# Altium project Heart_Rate_Monitor.PrjPCB
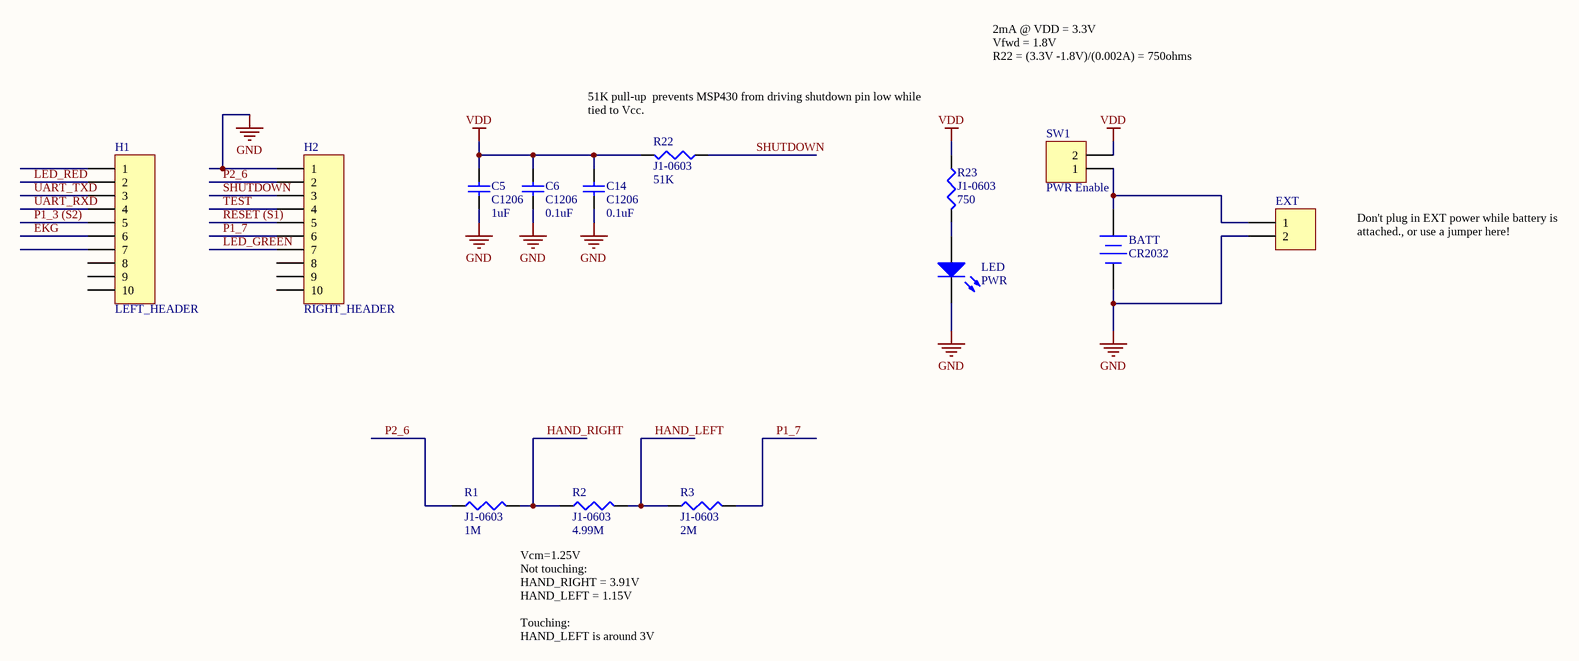
[diagram p0: Connector.SchDoc]
Name: Evan Reeves; Rev: A; Title: Heart Rate Monitor
2 sheets, 44 parts. Net scope: global (net labels, ports and power ports of the same name join across sheets).
Board file: Heart_Rate_Monitor.PcbDoc
Sheets:
  Connector.SchDoc
  Design.SchDoc

## Sheet Connector.SchDoc: Heart-Rate Monitor
size B; DrawnBy: Evan Reeves; Revision: A; SheetNumber: 1; SheetTotal: 2

### Parts
BATT  CR2032  [BAT_3003]
C5  C1206  value 1uF  [C1206]
C6  C1206  value 0.1uF  [C1206]
C14  C1206  value 0.1uF  [C1206]
EXT  (no value)  [BAT-2]
H1  LEFT_HEADER  [HDR1X10]
H2  RIGHT_HEADER  [HDR1X10]
LED  PWR  [RESC0603N]
R1  J1-0603  value 1M  [RESC0603N]
R2  J1-0603  value 4.99M  [RESC0603N]
R3  J1-0603  value 2M  [RESC0603N]
R22  J1-0603  value 51K  [RESC0603N]
R23  J1-0603  value 750  [RESC0603N]
SW1  PWR Enable  [HDR1X2]

### Nets
GND: BATT.2(-) C5.1 C6.1 C14.1 EXT.2 H2.1 LED.2(K)
VDD: C5.2 C6.2 C14.2 R22.2 R23.1 SW1.2
EKG: H1.6
HAND_LEFT: R2.2 R3.1
HAND_RIGHT: R1.2 R2.1
LED_GREEN: H2.7
LED_RED: H1.2
P1_3 (S2): H1.5
P1_7: H2.6 R3.2
P2_6: H2.2 R1.1
RESET (S1): H2.5
SHUTDOWN: H2.3 R22.1
TEST: H2.4
UART_RXD: H1.4
UART_TXD: H1.3
NetBATT_1: BATT.1(+) EXT.1 SW1.1
NetLED_1: LED.1(A) R23.2

Not connected (* = marked no-connect by the designer): H1 1 7 8 9 10; H2 8 9 10

### Notes on the sheet
- 2mA @ VDD = 3.3V
  Vfwd = 1.8V
  R22 = (3.3V -1.8V)/(0.002A) = 750ohms
- (near R22) 51K pull-up  prevents MSP430 from driving shutdown pin low while tied to Vcc.
- Don't plug in EXT power while battery is attached., or use a jumper here!
- Vcm=1.25V
  Not touching:
  HAND_RIGHT = 3.91V
  HAND_LEFT = 1.15V
  Touching:
  HAND_LEFT is around 3V
- Title
- Size:
- Date:
- B
- Number:
- Time:
- Revision:
- Sheet
- of
- File:

### Library data of the parts
BATT = Battery: Multicell Battery; pin to pad: 1>MH1; Published: 24-Mar-1999; LatestRevisionDate: 17-Jul-2002; LatestRevisionNote: Re-released for DXP Platform.; PackageReference: BAT-2; Publisher: Altium Limited; PackageDescription: Battery; 2 Leads
C5 C6 C14 = Cap Semi: Capacitor (Semiconductor SIM Model); Published: 8-Jun-2000; LatestRevisionDate: 29-May-2009; LatestRevisionNote: IPC-7351 Footprint Added.; PackageReference: C1206; Publisher: Altium Limited; PackageDescription: Chip Capacitor
EXT SW1 = Header 2: Header, 2-Pin; LatestRevisionDate: 17-Jul-2002; LatestRevisionNote: Re-released for DXP Platform.; Publisher: Altium Limited
H1 H2 = Header 10: Header, 10-Pin; LatestRevisionDate: 17-Jul-2002; LatestRevisionNote: Re-released for DXP Platform.; Publisher: Altium Limited
LED = LED2: RED LED; PN: SML-311UTT86; Published: 8-Jun-2000; LatestRevisionDate: 17-Jul-2002; LatestRevisionNote: Re-released for DXP Platform.; PackageVersion: Feb-2002; PackageReference: 0603; Publisher: Altium Limited; PackageDescription: SM LED; 2 Flat Leads; Link: https://www.digikey.com/product-detail/en/rohm-semiconductor/SML-311UTT86/511-1304-1-ND/637117
R1-R3 R22 R23 = Res3: Resistor; Published: 8-Jun-2000; LatestRevisionDate: 29-May-2009; LatestRevisionNote: IPC-7351 Footprint Added.; PackageReference: J1-0603; Publisher: Altium Limited; PackageDescription: Chip Resistor

## Sheet Design.SchDoc: Heart Rate Monitor
size B; DrawnBy: Evan Reeves; Revision: A; SheetNumber: 2; SheetTotal: 2
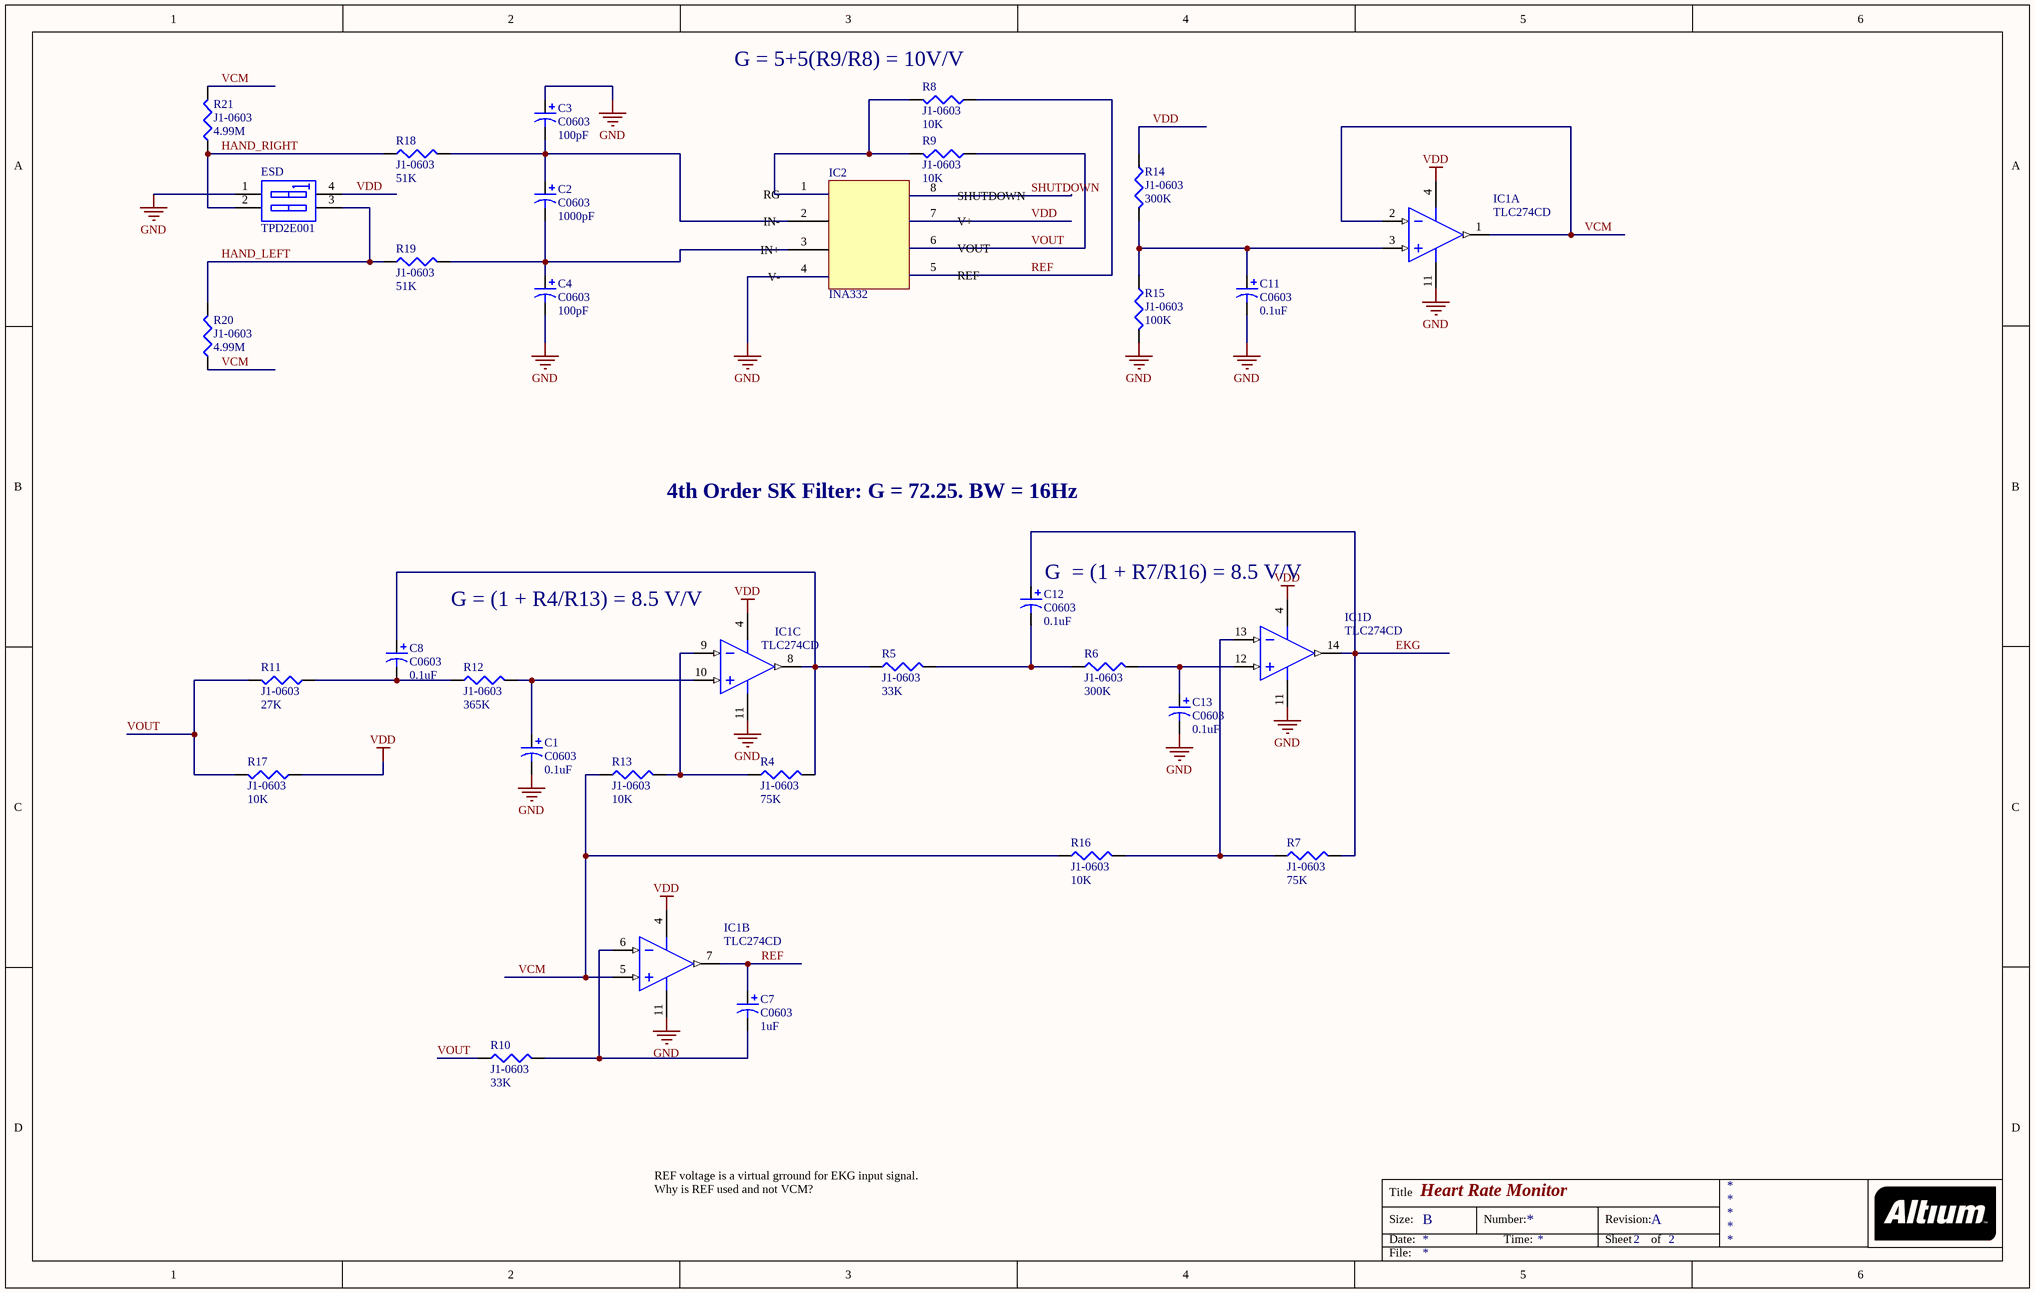
[diagram p1: Design.SchDoc]

### Parts
C1  C0603  value 0.1uF  [RESC0603N]
C2  C0603  value 1000pF  [RESC0603N]
C3  C0603  value 100pF  [RESC0603N]
C4  C0603  value 100pF  [RESC0603N]
C7  C0603  value 1uF  [RESC0603N]
C8  C0603  value 0.1uF  [RESC0603N]
C11  C0603  value 0.1uF  [RESC0603N]
C12  C0603  value 0.1uF  [RESC0603N]
C13  C0603  value 0.1uF  [RESC0603N]
ESD  TPD2E001  [SOT143N]
IC1  TLC274CD  [D014_N]  (parts A,B,C,D of 4)
IC2  INA332  [TSOP65P490-8AN]
R4  J1-0603  value 75K  [RESC0603N]
R5  J1-0603  value 33K  [RESC0603N]
R6  J1-0603  value 300K  [RESC0603N]
R7  J1-0603  value 75K  [RESC0603N]
R8  J1-0603  value 10K  [RESC0603N]
R9  J1-0603  value 10K  [RESC0603N]
R10  J1-0603  value 33K  [RESC0603N]
R11  J1-0603  value 27K  [RESC0603N]
R12  J1-0603  value 365K  [RESC0603N]
R13  J1-0603  value 10K  [RESC0603N]
R14  J1-0603  value 300K  [RESC0603N]
R15  J1-0603  value 100K  [RESC0603N]
R16  J1-0603  value 10K  [RESC0603N]
R17  J1-0603  value 10K  [RESC0603N]
R18  J1-0603  value 51K  [RESC0603N]
R19  J1-0603  value 51K  [RESC0603N]
R20  J1-0603  value 4.99M  [RESC0603N]
R21  J1-0603  value 4.99M  [RESC0603N]

### Nets
GND: C1.2 C3.1 C4.2 C11.2 C13.2 ESD.1(A1) IC1.11(V-) IC2.4(V-) R15.2
VDD: ESD.4(B1) IC1.4(V+) IC2.7(V+) R14.1 R17.1
EKG: C12.1 IC1.14(OUT) R7.2
HAND_LEFT: ESD.3(B2) R19.1 R20.2
HAND_RIGHT: ESD.2(A2) R18.1 R21.1
REF: C7.1 IC1.7(OUT) IC2.5(REF) R8.1
SHUTDOWN: IC2.8(SHUTDOWN)
VCM: IC1.1(OUT) IC1.2(IN-) IC1.5(IN+) R13.1 R16.1 R20.1 R21.2
VOUT: IC2.6(VOUT) R9.1 R10.1 R11.2 R17.2
NetC1_1: C1.1 IC1.10(IN+) R12.2
NetC2_1: C2.1 C3.2 IC2.2(IN-) R18.2
NetC2_2: C2.2 C4.1 IC2.3(IN+) R19.2
NetC7_2: C7.2 IC1.6(IN-) R10.2
NetC8_1: C8.1 IC1.8(OUT) R4.2 R5.1
NetC8_2: C8.2 R11.1 R12.1
NetC11_1: C11.1 IC1.3(IN+) R14.2 R15.1
NetC12_2: C12.2 R5.2 R6.1
NetC13_1: C13.1 IC1.12(IN+) R6.2
NetIC1_9: IC1.9(IN-) R4.1 R13.2
NetIC1_13: IC1.13(IN-) R7.1 R16.2
NetIC2_1: IC2.1(RG) R8.2 R9.2

### Notes on the sheet
- (near R8) G = 5+5(R9/R8) = 10V/V
- 4th Order SK Filter: G = 72.25. BW = 16Hz
- (near IC1) G = (1 + R4/R13) = 8.5 V/V
- (near C12) G  = (1 + R7/R16) = 8.5 V/V
- REF voltage is a virtual grround for EKG input signal. Why is REF used and not VCM?
- Title
- Size:
- Date:
- B
- Number:
- Time:
- Revision:
- Sheet
- of
- File:

### Library data of the parts
C1-C4 C7 C8 C11-C13 = Cap Pol3: Polarized Capacitor (Surface Mount); Published: 8-Jun-2000; LatestRevisionDate: 29-May-2009; LatestRevisionNote: IPC-7351 Footprint Added.; PackageReference: C0603; Publisher: Altium Limited; PackageDescription: Chip Capacitor
ESD = SW DIP-2: DIP Switch, 2 Position, SPST; Published: 24-Mar-1999; LatestRevisionDate: 17-Jul-2002; LatestRevisionNote: Re-released for DXP Platform.; PackageReference: DIP-4; Publisher: Altium Limited
IC1 = TLC274CD: LinCMOS Precision Quad Operational Amplifier; Published: 15-Apr-2002; LatestRevisionDate: 13-Apr-2006; LatestRevisionNote: IPC-7351 Footprint Added.; DatasheetVersion: Aug-1988; PackageVersion: Jan-1998; PackageReference: D014; Publisher: Altium Limited; PackageDescription: 14-Pin Small Outline Integrated Circuit 1.27 mm Pitch; Code_IPC: SOIC127P600-14; ComponentLink1Description: Manufacturer Link; ComponentLink1URL: http://www.ti.com/; ComponentLink2Description: Datasheet; ComponentLink2URL: http://www-s.ti.com/sc/ds/tlc274a.pdf
IC2 = INA332: Instrumentation Amp MSOP-8; PN: INA332AIDGK
R4-R21 = Res3: Resistor; Published: 8-Jun-2000; LatestRevisionDate: 29-May-2009; LatestRevisionNote: IPC-7351 Footprint Added.; PackageReference: J1-0603; Publisher: Altium Limited; PackageDescription: Chip Resistor

## Nets that join several sheets
GND: Connector (7 pins), Design (9 pins)
VDD: Connector (6 pins), Design (5 pins)
EKG: Connector (H1.6), Design (C12.1 IC1.14 R7.2)
HAND_LEFT: Connector (R2.2 R3.1), Design (ESD.3 R19.1 R20.2)
HAND_RIGHT: Connector (R1.2 R2.1), Design (ESD.2 R18.1 R21.1)
SHUTDOWN: Connector (H2.3 R22.1), Design (IC2.8)